# Altium schematic sheet [05] - CPU IO.SchDoc: CPU IO
size A4; Organization: Bjørn T. Brodtkorb; Address1: Frode Rinnans veg 161; Address2: 7050 Trondheim; DocumentNumber: 6; Revision: 1.0; SheetNumber: 6; SheetTotal: 13
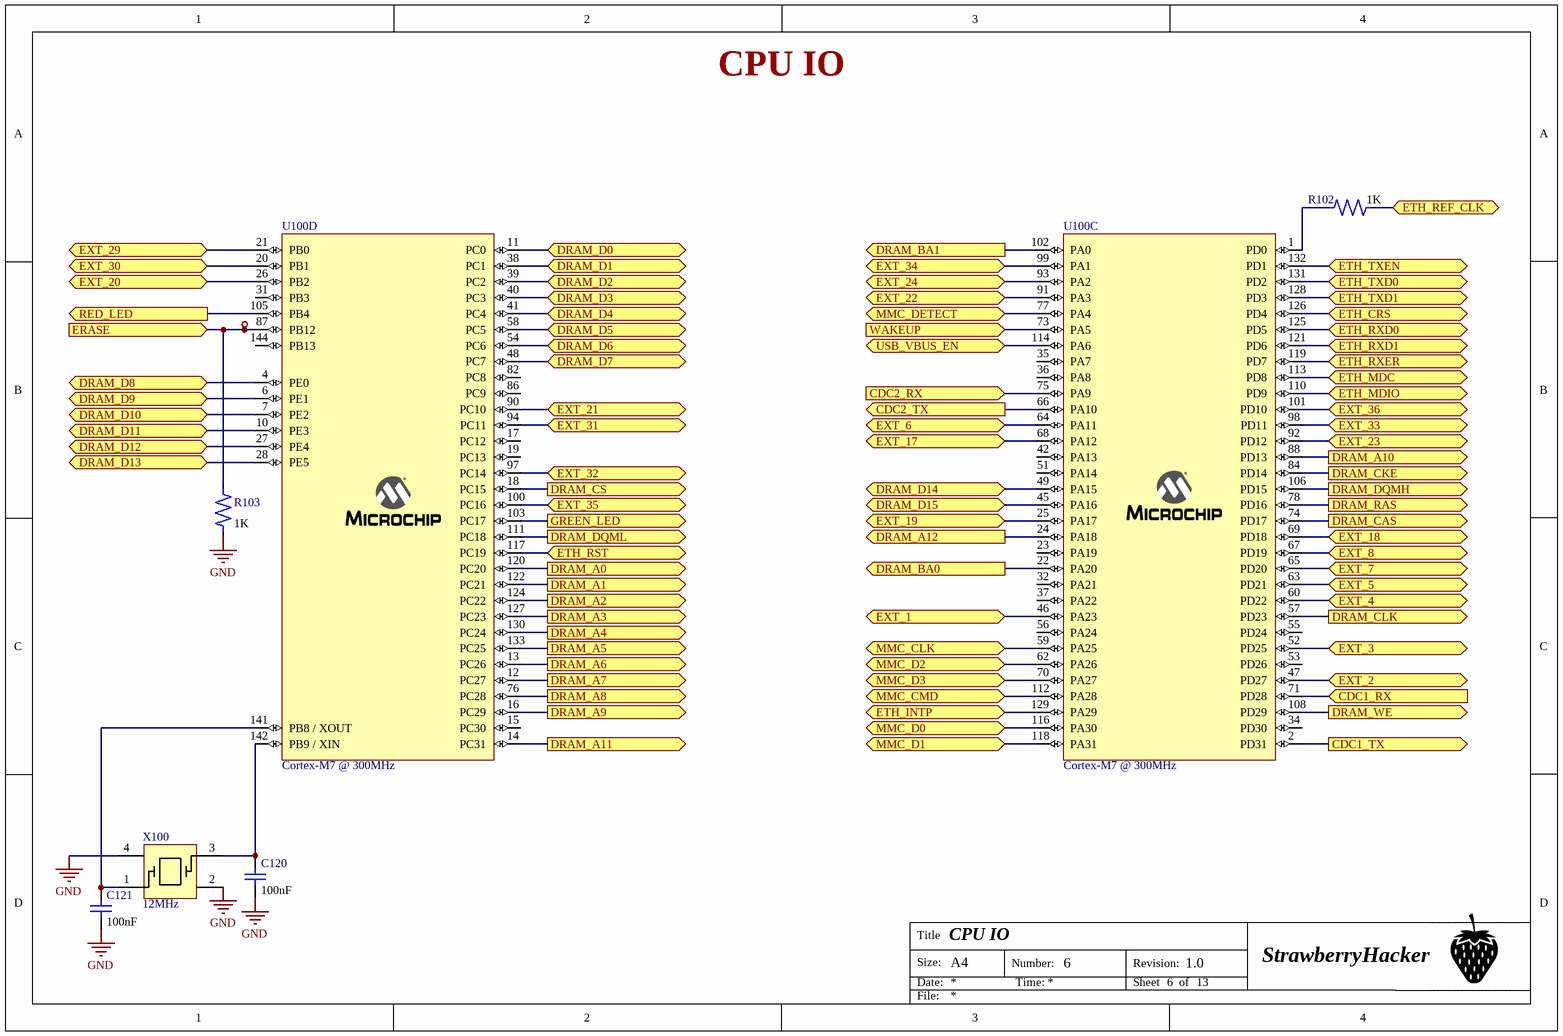
[diagram p0: [05] - CPU IO.SchDoc]

## Parts
C120  value 100nF  [C0402]  (hidden comment: 04023C103KAT2A)
C121  value 100nF  [C0402]  (hidden comment: 04023C103KAT2A)
R102  value 1K  [R0402]  (hidden comment: CRCW04020000Z0ED)
R103  value 1K  [R0402]  (hidden comment: CRCW04020000Z0ED)
TP100  Test point  [TEST POINT]  (value not drawn)
U100  Cortex-M7 @ 300MHz  [ATSAMS70Q21A-AN]  (parts C,D of 4)
X100  12MHz  [MCSJK-7U-12.00-12-30-80-B-30]

## Ports
CDC1_RX (in), CDC1_TX (out), CDC2_RX (in), CDC2_TX (out), DRAM_A0 (out), DRAM_A1 (out), DRAM_A2 (out), DRAM_A3 (out), DRAM_A4 (out), DRAM_A5 (out), DRAM_A6 (out), DRAM_A7 (out), DRAM_A8 (out), DRAM_A9 (out), DRAM_A10 (out), DRAM_A11 (out), DRAM_A12 (out), DRAM_BA0 (out), DRAM_BA1 (out), DRAM_CAS (out), DRAM_CKE (out), DRAM_CLK (out), DRAM_CS (out), DRAM_D0 (bidir), DRAM_D1 (bidir), DRAM_D2 (bidir), DRAM_D3 (bidir), DRAM_D4 (bidir), DRAM_D5 (bidir), DRAM_D6 (bidir), DRAM_D7 (bidir), DRAM_D8 (bidir), DRAM_D9 (bidir), DRAM_D10 (bidir), DRAM_D11 (bidir), DRAM_D12 (bidir), DRAM_D13 (bidir), DRAM_D14 (bidir), DRAM_D15 (bidir), DRAM_DQMH (out), DRAM_DQML (out), DRAM_RAS (out), DRAM_WE (out), ERASE (in), ETH_CRS (bidir), ETH_INTP (bidir), ETH_MDC (bidir), ETH_MDIO (bidir), ETH_REF_CLK (bidir), ETH_RST (bidir), ETH_RXD0 (bidir), ETH_RXD1 (bidir), ETH_RXER (bidir), ETH_TXD0 (bidir), ETH_TXD1 (bidir), ETH_TXEN (bidir), EXT_1 (bidir), EXT_2 (bidir), EXT_3 (bidir), EXT_4 (bidir), EXT_5 (bidir), EXT_6 (bidir), EXT_7 (bidir), EXT_8 (bidir), EXT_17 (bidir), EXT_18 (bidir), EXT_19 (bidir), EXT_20 (bidir), EXT_21 (bidir), EXT_22 (bidir), EXT_23 (bidir), EXT_24 (bidir), EXT_29 (bidir), EXT_30 (bidir), EXT_31 (bidir), EXT_32 (bidir), EXT_33 (bidir), EXT_34 (bidir), EXT_35 (bidir), EXT_36 (bidir), GREEN_LED (out), MMC_CLK (bidir), MMC_CMD (bidir), MMC_D0 (bidir), MMC_D1 (bidir), MMC_D2 (bidir), MMC_D3 (bidir), MMC_DETECT (bidir), RED_LED (out), USB_VBUS_EN (bidir), WAKEUP (in)

## Nets
GND: C120.1 C121.1 R103.1 X100.2 X100.4
CDC1_RX: U100.71(PD28) ; port CDC1_RX
CDC1_TX: U100.2(PD31) ; port CDC1_TX
CDC2_RX: U100.75(PA9) ; port CDC2_RX
CDC2_TX: U100.66(PA10) ; port CDC2_TX
DRAM_A0: U100.120(PC20) ; port DRAM_A0
DRAM_A1: U100.122(PC21) ; port DRAM_A1
DRAM_A2: U100.124(PC22) ; port DRAM_A2
DRAM_A3: U100.127(PC23) ; port DRAM_A3
DRAM_A4: U100.130(PC24) ; port DRAM_A4
DRAM_A5: U100.133(PC25) ; port DRAM_A5
DRAM_A6: U100.13(PC26) ; port DRAM_A6
DRAM_A7: U100.12(PC27) ; port DRAM_A7
DRAM_A8: U100.76(PC28) ; port DRAM_A8
DRAM_A9: U100.16(PC29) ; port DRAM_A9
DRAM_A10: U100.88(PD13) ; port DRAM_A10
DRAM_A11: U100.14(PC31) ; port DRAM_A11
DRAM_A12: U100.24(PA18) ; port DRAM_A12
DRAM_BA0: U100.22(PA20) ; port DRAM_BA0
DRAM_BA1: U100.102(PA0) ; port DRAM_BA1
DRAM_CAS: U100.74(PD17) ; port DRAM_CAS
DRAM_CKE: U100.84(PD14) ; port DRAM_CKE
DRAM_CLK: U100.57(PD23) ; port DRAM_CLK
DRAM_CS: U100.18(PC15) ; port DRAM_CS
DRAM_D0: U100.11(PC0) ; port DRAM_D0
DRAM_D1: U100.38(PC1) ; port DRAM_D1
DRAM_D2: U100.39(PC2) ; port DRAM_D2
DRAM_D3: U100.40(PC3) ; port DRAM_D3
DRAM_D4: U100.41(PC4) ; port DRAM_D4
DRAM_D5: U100.58(PC5) ; port DRAM_D5
DRAM_D6: U100.54(PC6) ; port DRAM_D6
DRAM_D7: U100.48(PC7) ; port DRAM_D7
DRAM_D8: U100.4(PE0) ; port DRAM_D8
DRAM_D9: U100.6(PE1) ; port DRAM_D9
DRAM_D10: U100.7(PE2) ; port DRAM_D10
DRAM_D11: U100.10(PE3) ; port DRAM_D11
DRAM_D12: U100.27(PE4) ; port DRAM_D12
DRAM_D13: U100.28(PE5) ; port DRAM_D13
DRAM_D14: U100.49(PA15) ; port DRAM_D14
DRAM_D15: U100.45(PA16) ; port DRAM_D15
DRAM_DQMH: U100.106(PD15) ; port DRAM_DQMH
DRAM_DQML: U100.111(PC18) ; port DRAM_DQML
DRAM_RAS: U100.78(PD16) ; port DRAM_RAS
DRAM_WE: U100.108(PD29) ; port DRAM_WE
ERASE: R103.2 TP100.1 U100.87(PB12) ; port ERASE
ETH_CRS: U100.126(PD4) ; port ETH_CRS
ETH_INTP: U100.129(PA29) ; port ETH_INTP
ETH_MDC: U100.113(PD8) ; port ETH_MDC
ETH_MDIO: U100.110(PD9) ; port ETH_MDIO
ETH_REF_CLK: R102.2 ; port ETH_REF_CLK
ETH_RST: U100.117(PC19) ; port ETH_RST
ETH_RXD0: U100.125(PD5) ; port ETH_RXD0
ETH_RXD1: U100.121(PD6) ; port ETH_RXD1
ETH_RXER: U100.119(PD7) ; port ETH_RXER
ETH_TXD0: U100.131(PD2) ; port ETH_TXD0
ETH_TXD1: U100.128(PD3) ; port ETH_TXD1
ETH_TXEN: U100.132(PD1) ; port ETH_TXEN
EXT_1: U100.46(PA23) ; port EXT_1
EXT_2: U100.47(PD27) ; port EXT_2
EXT_3: U100.52(PD25) ; port EXT_3
EXT_4: U100.60(PD22) ; port EXT_4
EXT_5: U100.63(PD21) ; port EXT_5
EXT_6: U100.64(PA11) ; port EXT_6
EXT_7: U100.65(PD20) ; port EXT_7
EXT_8: U100.67(PD19) ; port EXT_8
EXT_17: U100.68(PA12) ; port EXT_17
EXT_18: U100.69(PD18) ; port EXT_18
EXT_19: U100.25(PA17) ; port EXT_19
EXT_20: U100.26(PB2) ; port EXT_20
EXT_21: U100.90(PC10) ; port EXT_21
EXT_22: U100.91(PA3) ; port EXT_22
EXT_23: U100.92(PD12) ; port EXT_23
EXT_24: U100.93(PA2) ; port EXT_24
EXT_29: U100.21(PB0) ; port EXT_29
EXT_30: U100.20(PB1) ; port EXT_30
EXT_31: U100.94(PC11) ; port EXT_31
EXT_32: U100.97(PC14) ; port EXT_32
EXT_33: U100.98(PD11) ; port EXT_33
EXT_34: U100.99(PA1) ; port EXT_34
EXT_35: U100.100(PC16) ; port EXT_35
EXT_36: U100.101(PD10) ; port EXT_36
GREEN_LED: U100.103(PC17) ; port GREEN_LED
MMC_CLK: U100.59(PA25) ; port MMC_CLK
MMC_CMD: U100.112(PA28) ; port MMC_CMD
MMC_D0: U100.116(PA30) ; port MMC_D0
MMC_D1: U100.118(PA31) ; port MMC_D1
MMC_D2: U100.62(PA26) ; port MMC_D2
MMC_D3: U100.70(PA27) ; port MMC_D3
MMC_DETECT: U100.77(PA4) ; port MMC_DETECT
RED_LED: U100.105(PB4) ; port RED_LED
USB_VBUS_EN: U100.114(PA6) ; port USB_VBUS_EN
WAKEUP: U100.73(PA5) ; port WAKEUP
NetC120_2: C120.2 U100.142(PB9_/_XIN) X100.3
NetC121_2: C121.2 U100.141(PB8_/_XOUT) X100.1
NetR102_1: R102.1 U100.1(PD0)

Not connected (* = marked no-connect by the designer): U100 15(PC30) 17(PC12) 19(PC13) 23(PA19) 31(PB3) 32(PA21) 34(PD30) 35(PA7) 36(PA8) 37(PA22) 42(PA13) 51(PA14) 53(PD26) 55(PD24) 56(PA24) 82(PC8) 86(PC9) 144(PB13)

## Notes on the sheet
- CPU IO
- Title
- Size:
- Date:
- A4
- Number:
- Time:
- Revision:
- Sheet
- of
- StrawberryHacker
- File:

## Library data of the parts
C120 C121 = 04023C103KAT2A: C0402
R102 R103 = CRCW04020000Z0ED: R0402
U100 = ATSAMS70Q21A-AN: ATSAMS70Q21; Supplier Part Number 1: 2484397; Supplier 1: Farnell
X100 = MCSJK-7U-12.00-12-30-80-B-30: Crystal 12MHz 3.2mm x 2.5mm; Supplier Part Number 1: 2853917; Supplier 1: Farnell